# EAGLE design MPR121-Breakout-v12 (EAGLE 6.4)
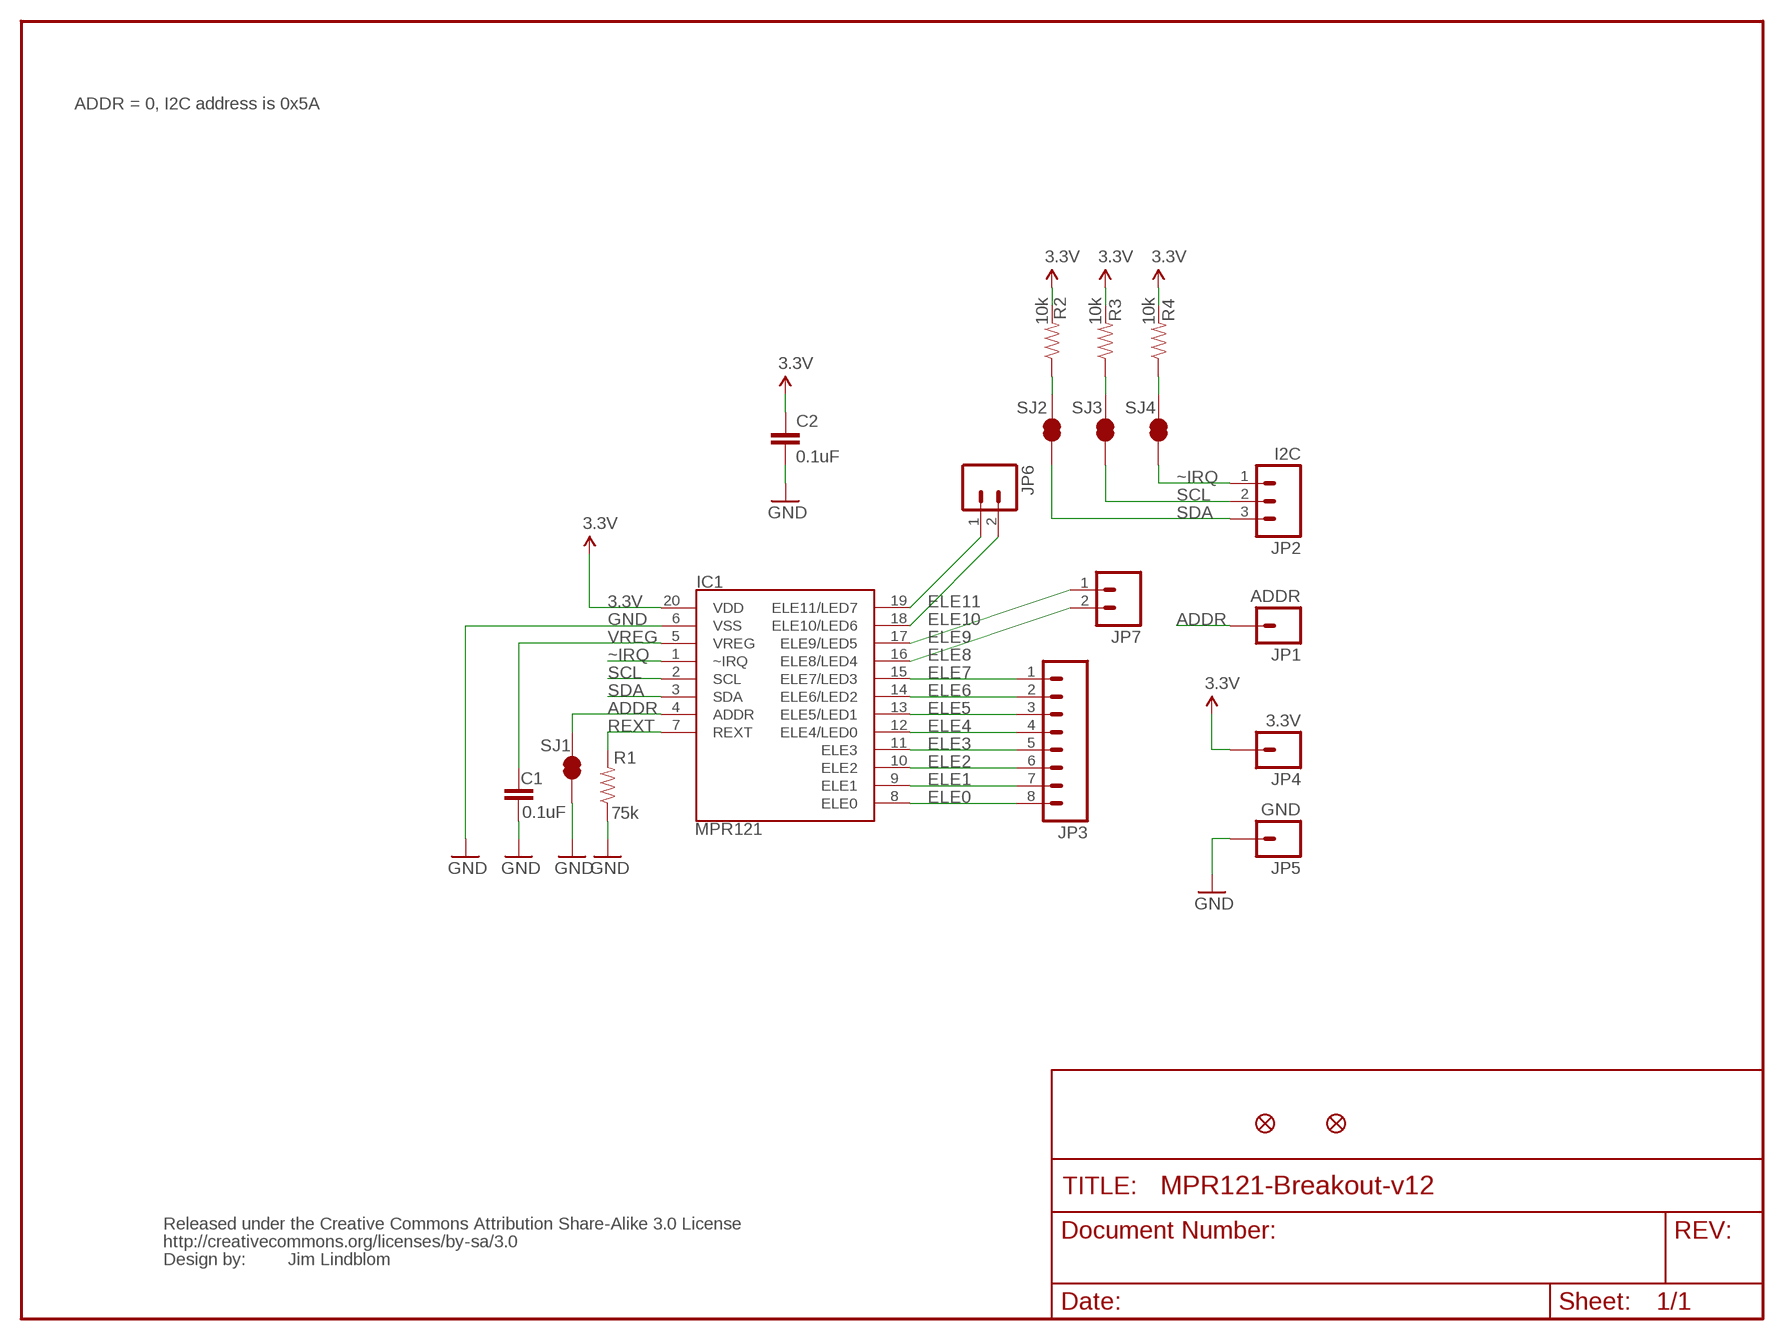
[diagram p0: schematic, sheet 1]

## Parts
C1  0.1uF  CAP0603-CAP  [0603-CAP]
C2  0.1uF  CAP0603-CAP  [0603-CAP]
IC1  MPR121  MPR121QFN20  [QFN-20-0.4MM]
JP1  ADDR  M01PTH  [1X01]
JP2  I2C  M03PTH  [1X03]
JP3  M081X08  [1X08]
JP4  3.3V  M01PTH  [1X01]
JP5  GND  M01PTH  [1X01]
JP6  M02LOCK  [1X02_LOCK]
JP7  M02LOCK  [1X02_LOCK]
JP8  FIDUCIAL1X2  [FIDUCIAL-1X2]
JP9  FIDUCIAL1X2  [FIDUCIAL-1X2]
R1  75k  RESISTOR0603-RES  [0603-RES]
R2  10k  RESISTOR0603-RES  [0603-RES]
R3  10k  RESISTOR0603-RES  [0603-RES]
R4  10k  RESISTOR0603-RES  [0603-RES]
SJ1  SOLDERJUMPERNO  [SJ_2S-NO]
SJ2  SOLDERJUMPERNO  [SJ_2S-NO]
SJ3  SOLDERJUMPERNO  [SJ_2S-NO]
SJ4  SOLDERJUMPERNO  [SJ_2S-NO]
U$1  CREATIVE_COMMONS  [CREATIVE_COMMONS]

## Nets
3.3V: C2.1 IC1.20(VDD) JP4.1 R2.2 R3.2 R4.2
ADDR: IC1.4(ADDR) JP1.1 SJ1.2
ELE0: IC1.8(ELE0) JP3.8
ELE1: IC1.9(ELE1) JP3.7
ELE2: IC1.10(ELE2) JP3.6
ELE3: IC1.11(ELE3) JP3.5
ELE4: IC1.12(ELE4/LED0) JP3.4
ELE5: IC1.13(ELE5/LED1) JP3.3
ELE6: IC1.14(ELE6/LED2) JP3.2
ELE7: IC1.15(ELE7/LED3) JP3.1
ELE8: IC1.16(ELE8/LED4) JP7.2
ELE9: IC1.17(ELE9/LED5) JP7.1
ELE10: IC1.18(ELE10/LED6) JP6.2
ELE11: IC1.19(ELE11/LED7) JP6.1
GND: C1.2 C2.2 IC1.6(VSS) JP5.1 R1.1 SJ1.1
REXT: IC1.7(REXT) R1.2
SCL: IC1.2(SCL) JP2.2 SJ3.1
SCL_PU: R3.1 SJ3.2
SDA: IC1.3(SDA) JP2.3 SJ2.1
SDA_PU: R2.1 SJ2.2
VREG: C1.1 IC1.5(VREG)
~IRQ: IC1.1(~IRQ) JP2.1 SJ4.1
~IRQ_PU: R4.1 SJ4.2

## Notes on the sheet
- ADDR = 0, I2C address is 0x5A
- Jim Lindblom

## Library data of the parts
C1 C2 = SparkFun:CAP: Capacitor Standard 0603 ceramic capacitor, and 0.1" leaded capacitor.
IC1 = SparkFun:MPR121: MPR121 Capacitive Touch Sensor Controller
JP1 JP4 JP5 = SparkFun:M01: Header 1 Standard 1-pin 0.1" header. Use with straight break away headers (SKU : PRT-00116), right angle break away headers (PRT-00553), swiss pins (PRT-00743), machine pins (PRT-00117), and female headers (PRT-00115).
JP2 = SparkFun:M03: Header 3 Standard 3-pin 0.1" header. Use with straight break away headers (SKU : PRT-00116), right angle break away headers (PRT-00553), swiss pins (PRT-00743), machine pins (PRT-00117), and female headers (PRT-00115). Molex polarized connector foot print use with SKU : PRT-08232 with associated crimp pins and housings.
JP3 = SparkFun:M08: Header 8 Standard 8-pin 0.1" header. Use with straight break away headers (SKU : PRT-00116), right angle break away headers (PRT-00553), swiss pins (PRT-00743), machine pins (PRT-00117), and female headers (PRT-00115).
JP6 JP7 = SparkFun:M02: Header 2 Standard 2-pin 0.1" header. Use with straight break away headers (SKU : PRT-00116), right angle break away headers (PRT-00553), swiss pins (PRT-00743), machine pins (PRT-00117), and female headers (PRT-00115). Molex polarized connector foot print use with SKU : PRT-08233 with associated crimp pins and housings.
JP8 JP9 = SparkFun:FIDUCIAL: Fiducial Alignment Points Various fiducial points for machine vision alignment.
R1-R4 = SparkFun:RESISTOR: Resistor Basic schematic elements and footprints for 0603, 1206, and PTH 1/10th watt (small) resistors.
SJ1-SJ4 = SparkFun:SOLDERJUMPER: Solder Jumper Standard SMD solder jumper. Used to automate production. Two varients : Normally Open and Normally Closed are the same, but have different paste layers. NC will have a large amount of paste and should jumper during reflow.
U$1 = SparkFun:CREATIVE_COMMONS

## Board
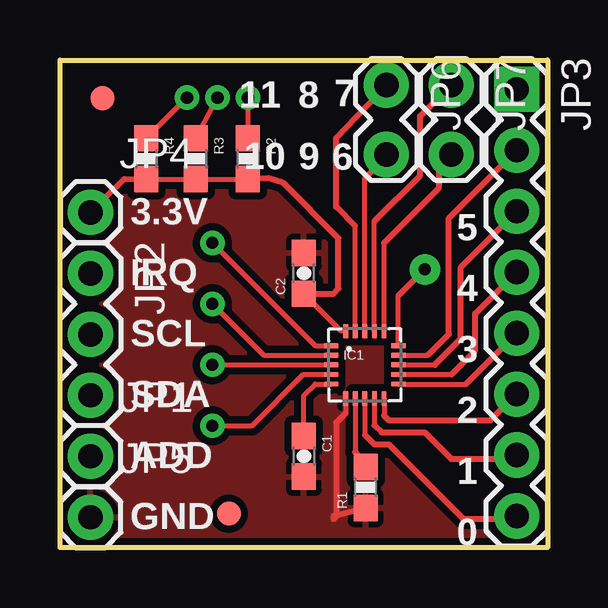
[diagram p1: board, top side]
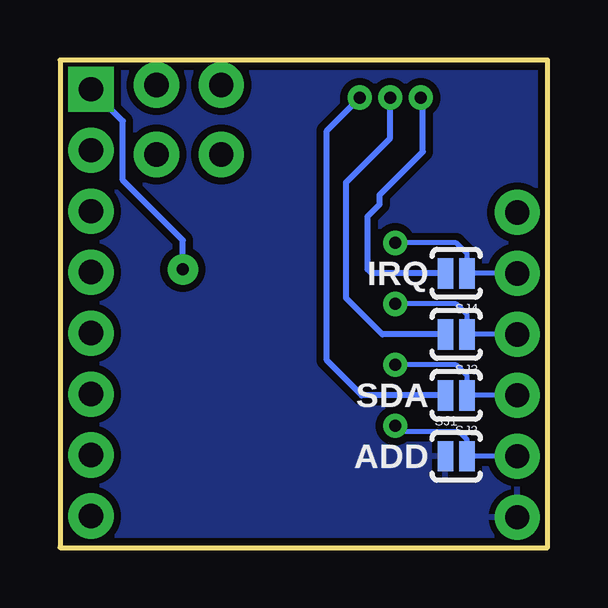
[diagram p2: board, bottom side, seen from below]

Size 20.32 x 20.32 mm. Coordinates in mm from the lower left corner, seen from the top.
Outline: 0,0 0,20.32 20.32,20.32 20.32,0 0,0
Copper layers (1*16): Top 0.035mm / dielectric 1.5mm / Bottom 0.035mm
Design rules "SparkFun": minimum track width 8mil, minimum drill 20mil, track to track 8mil, track to pad 8mil, pad to pad 8mil, via to via 8mil, smd to smd 8mil, copper to edge 9mil, drill to drill 8mil, minimum pad ring 12mil, minimum via ring 10mil, stop-mask expansion 4mil, vias tented up to drill 20mil, thermal gap 10mil

### Footprints (pad centres in the part's own frame; a part is rotated, then mirrored left to right if it is on the bottom)
0603-CAP = smd 1.1 x 1: 1 -0.85,0; 2 0.85,0
QFN-20-0.4MM = smd 0.6 x 0.2: 1 -1.4,0.8; 2 -1.4,0.4; 3 -1.4,0; 4 -1.4,-0.4; 5 -1.4,-0.8; 11 1.4,-0.8; 12 1.4,-0.4; 13 1.4,0; 14 1.4,0.4; 15 1.4,0.8 | smd 0.2 x 0.6: 6 -0.8,-1.4; 7 -0.4,-1.4; 8 0,-1.4; 9 0.4,-1.4; 10 0.8,-1.4; 16 0.8,1.4; 17 0.4,1.4; 18 0,1.4; 19 -0.4,1.4; 20 -0.8,1.4
1X01 = drill 1.016 pad 1.88: 1 0,0
1X03 = drill 1.016 pad 1.88: 1 0,0; 2 2.54,0; 3 5.08,0
1X08 = drill 1.016 pad 1.88 square: 1 0,0 | drill 1.016 pad 1.88: 2 2.54,0; 3 5.08,0; 4 7.62,0; 5 10.16,0; 6 12.7,0; 7 15.24,0; 8 17.78,0
1X02_LOCK = drill 1.016 pad 1.88: 1 -0.178,0; 2 2.718,0
FIDUCIAL-1X2 = smd 1 x 1: 1 0,0
0603-RES = smd 1.1 x 1: 1 -0.85,0; 2 0.85,0
SJ_2S-NO = smd 0.635 x 1.27: 1 -0.45,0; 2 0.45,0

### Placement (x,y rotation side)
C1  10.16,3.81 270 top
C2  10.16,11.43 90 top
IC1  12.7,7.62 0 top
JP1  1.27,3.81 0 top
JP2  1.27,11.43 270 top
JP3  19.03,19.1 270 top
JP4  1.27,13.97 0 top
JP5  1.27,1.27 0 top
JP6  13.6,19.1 270 top
JP7  16.3,19.1 270 top
JP8  1.77,18.73 0 top
JP9  7.04,1.42 0 top
R1  12.73,2.51 90 top
R2  7.83,16.21 270 top
R3  5.66,16.21 270 top
R4  3.59,16.21 270 top
SJ1  3.81,3.81 0 bottom
SJ2  3.81,6.35 180 bottom
SJ3  3.81,8.89 180 bottom
SJ4  3.81,11.43 180 bottom
U$1  19.05,-8.89 0 top  (outside the outline)

### Tracks (layer width: path | path; a pad name or v marks a point on that pad's centre or on a via)
3.3V
  Top 0.2: IC1.20 11.72,9.02 C2.1
  Top 0.203: R4.2 R3.2 R2.2
  Top 0.254: JP4.1 2.7,15.37 R4.2 | C2.1 11.38,10.58 11.6,10.8 11.6,12.9 9.3,15.2 8.69,15.4 R2.2
ADDR  (via drill 0.51)
  Top 0.2: 10.14,7.22 IC1.4
  Top 0.203: v6.35,5.08 8,5.08 10.14,7.22
  Bottom 0.203: JP1.1 SJ1.2 3.36,4.5 3.68,4.83 6.1,4.83 v6.35,5.08
ELE0
  Top 0.2: IC1.8 12.7,4.7
  Top 0.254: 12.7,4.7 13.1,4.3 13.7,4.3 16.8,1.2 18.91,1.2 JP3.8
ELE1
  Top 0.2: IC1.9 13.1,5.1
  Top 0.254: 13.1,5.1 13.4,4.8 15.2,4.8 16.3,3.7 18.87,3.7 JP3.7
ELE2
  Top 0.2: IC1.10 13.5,5.5
  Top 0.254: 13.5,5.5 13.7,5.3 17.93,5.3 JP3.6
ELE3
  Top 0.2: IC1.11 16.91,6.82
  Top 0.254: 16.91,6.82 JP3.5
ELE4
  Top 0.2: IC1.12 16.32,7.22
  Top 0.254: 16.32,7.22 17.3,8.2 17.3,9.75 JP3.4
ELE5
  Top 0.2: IC1.13 15.62,7.62
  Top 0.254: 15.62,7.62 16.7,8.7 16.7,11.69 JP3.3
ELE6
  Top 0.2: IC1.14 15.32,8.02
  Top 0.254: 15.32,8.02 16.2,8.9 16.2,13.73 JP3.2
ELE7  (via drill 0.5 pad 1.27)
  Top 0.2: IC1.15 14.1,10.5
  Top 0.254: 14.1,10.5 v15.2,11.6
  Bottom 0.254: v15.2,11.6 15.2,12.8 17.7,15.3 17.7,17.77 JP3.1
ELE8
  Top 0.2: IC1.16 13.5,12.7
  Top 0.254: 13.5,12.7 15.8,15 15.8,15.88 JP7.2
ELE9
  Top 0.2: IC1.17 13.1,13.6
  Top 0.254: 13.1,13.6 15,15.5 15,17.98 JP7.1
ELE10
  Top 0.2: IC1.18 12.7,15.38
  Top 0.254: 12.7,15.38 JP6.2
ELE11
  Top 0.2: IC1.19 12.3,13.4
  Top 0.254: 12.3,13.4 11.5,14.2 11.5,17.08 JP6.1
GND
  Top 0.2: IC1.6 11.9,5.6
  Top 0.254: 11.9,5.6 11.5,5.2 11.5,1.3 11.4,1.2 11.4,1.33 R1.1
  pour Top (isolate 0.305): 0,20.32 0,0 20.32,0 20.32,20.32
  pour Bottom (isolate 0.305): 0,20.32 0,0 20.32,0 20.32,20.32
REXT
  Top 0.2: IC1.7 12.3,3.99
  Top 0.254: 12.3,3.99 R1.2
SCL  (via drill 0.51)
  Top 0.2: 8.49,8.02 IC1.2
  Top 0.203: v6.35,10.16 8.49,8.02
  Bottom 0.203: JP2.2 SJ3.1 3.36,9.71 3.81,10.16 v6.35,10.16
SCL_PU  (via drill 0.51)
  Top 0.203: v6.56,18.75 R3.1
  Bottom 0.254: SJ3.2 6.89,8.89 8.4,10.4 8.4,15.22 6.56,17.06 v6.56,18.75
SDA  (via drill 0.51)
  Top 0.2: v6.35,7.62 IC1.3
  Bottom 0.203: JP2.3 SJ2.1 3.36,7.17 3.81,7.62 v6.35,7.62
SDA_PU  (via drill 0.51)
  Top 0.203: v7.83,18.75 R2.1
  Bottom 0.254: SJ2.2 7.75,6.35 9.2,7.8 9.2,17.38 v7.83,18.75
VREG
  Top 0.2: IC1.5 10.63,6.82 10.16,6.35
  Top 0.203: C1.1 10.16,6.35
~IRQ  (via drill 0.51)
  Top 0.2: 10.63,8.42 IC1.1
  Top 0.203: v6.35,12.7 10.63,8.42
  Bottom 0.203: JP2.1 SJ4.1 3.36,12.25 3.81,12.7 v6.35,12.7
~IRQ_PU  (via drill 0.51)
  Top 0.203: v5.29,18.75 R4.1
  Bottom 0.254: SJ4.2 7.33,11.43 7.5,11.6 7.5,13.8 7,14.3 7,14.7 5.2,16.5 5.2,18.66 v5.29,18.75

### Text on the board
tPlace: 11 | 8 | 7 | 10 | 9 | 6 | 5 | 3.3V | IRQ | 4 | 3 | SCL | SDA | 2 | 1 | ADD | GND | 0
bPlace: IRQ | SDA | ADD